# EAGLE schematic F2CE_V3_Main (EAGLE 9.6.2)
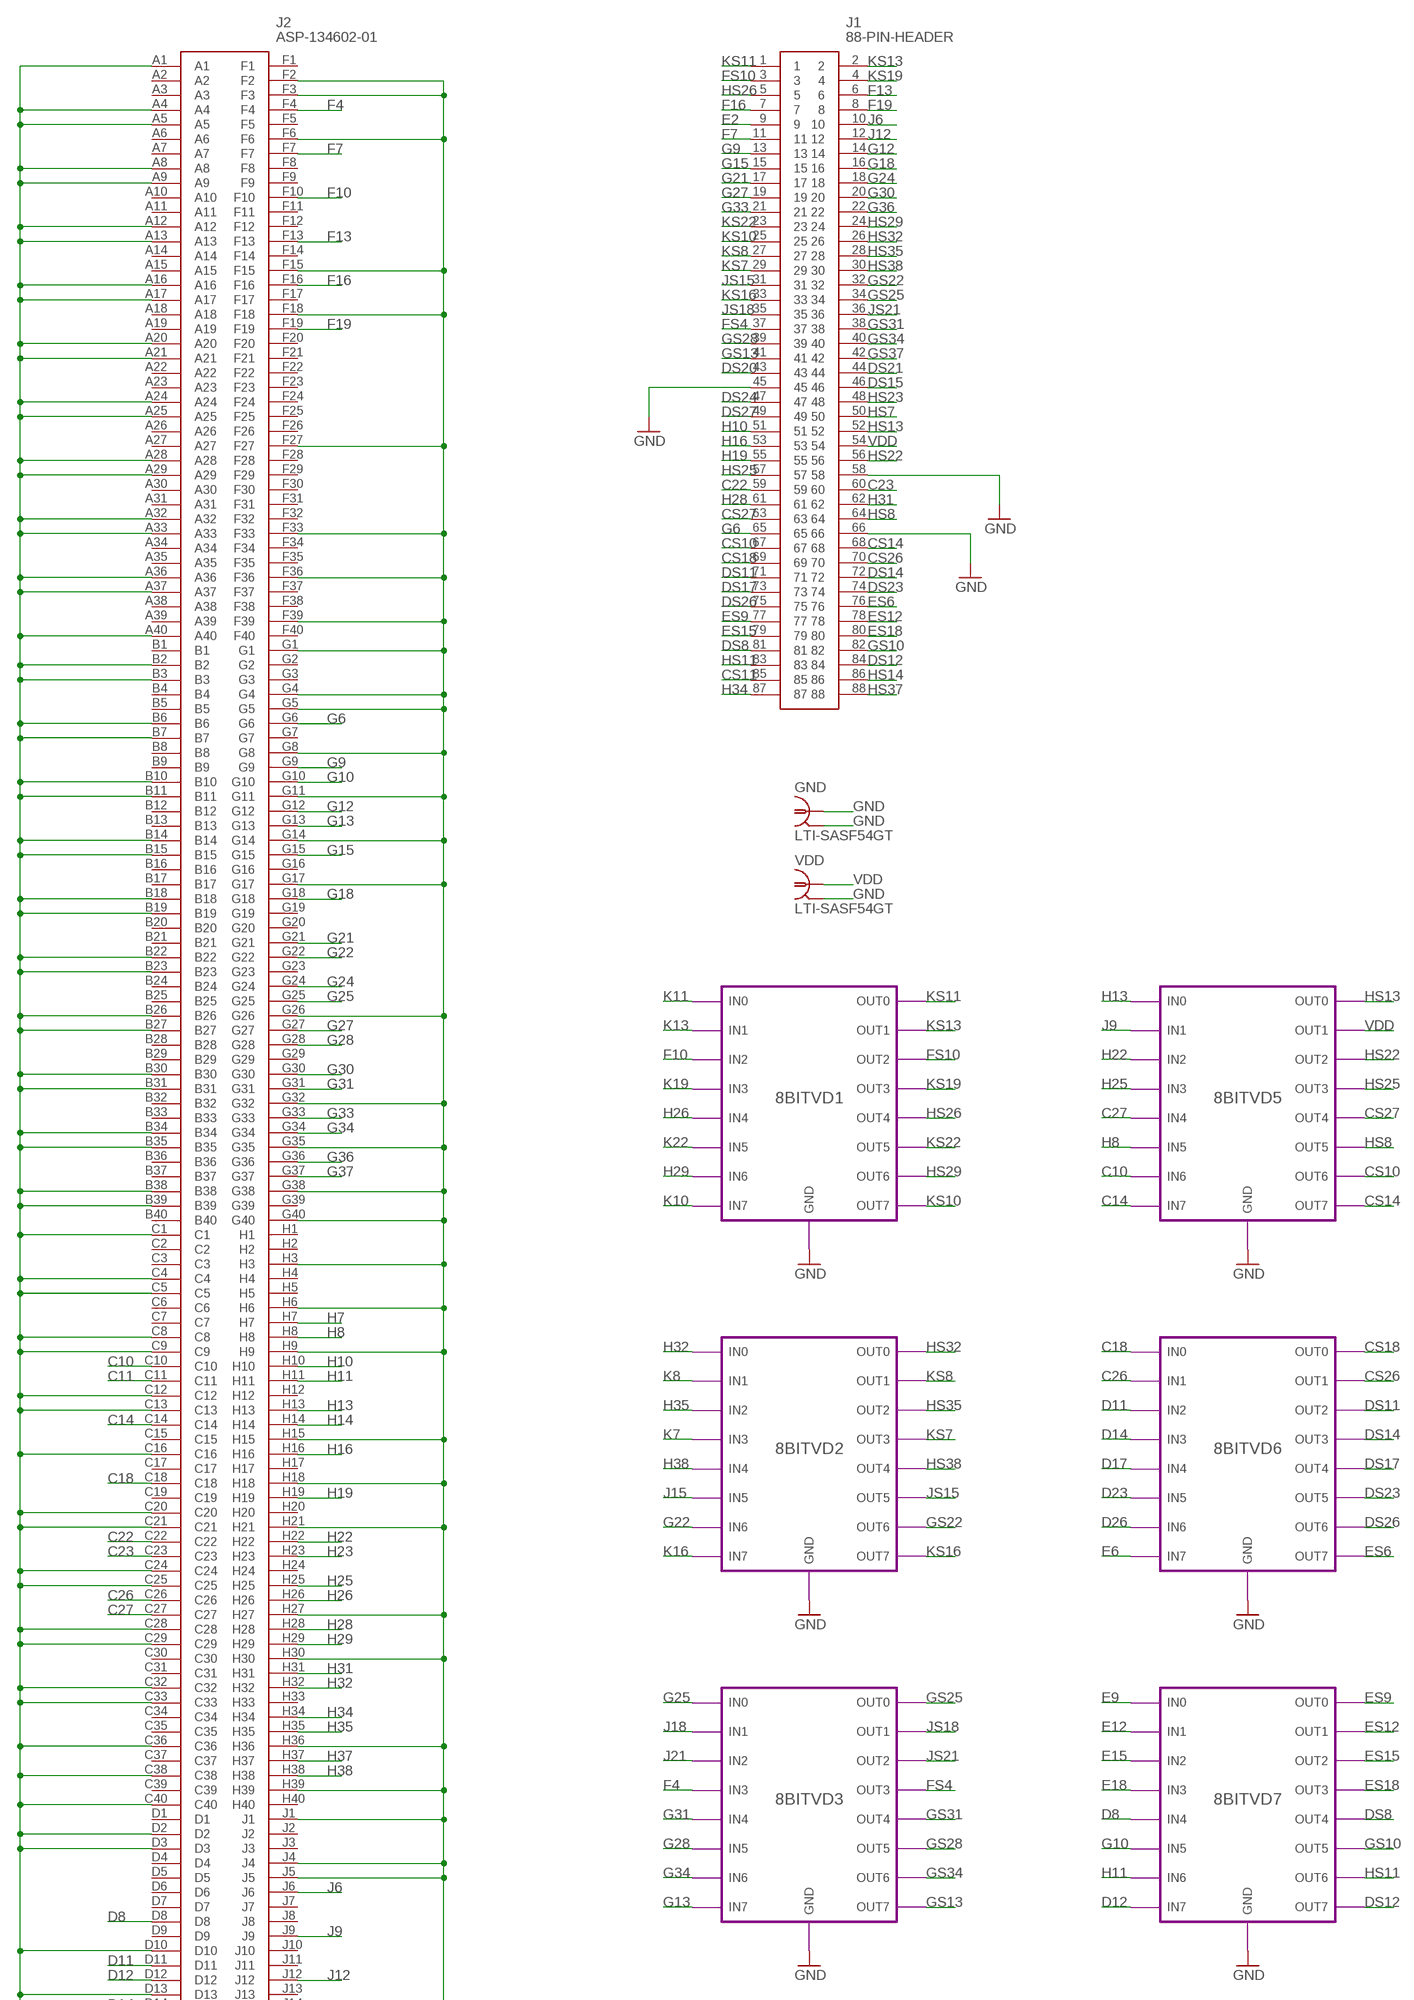
[diagram p0: schematic, sheet 1, part 1 of 2]
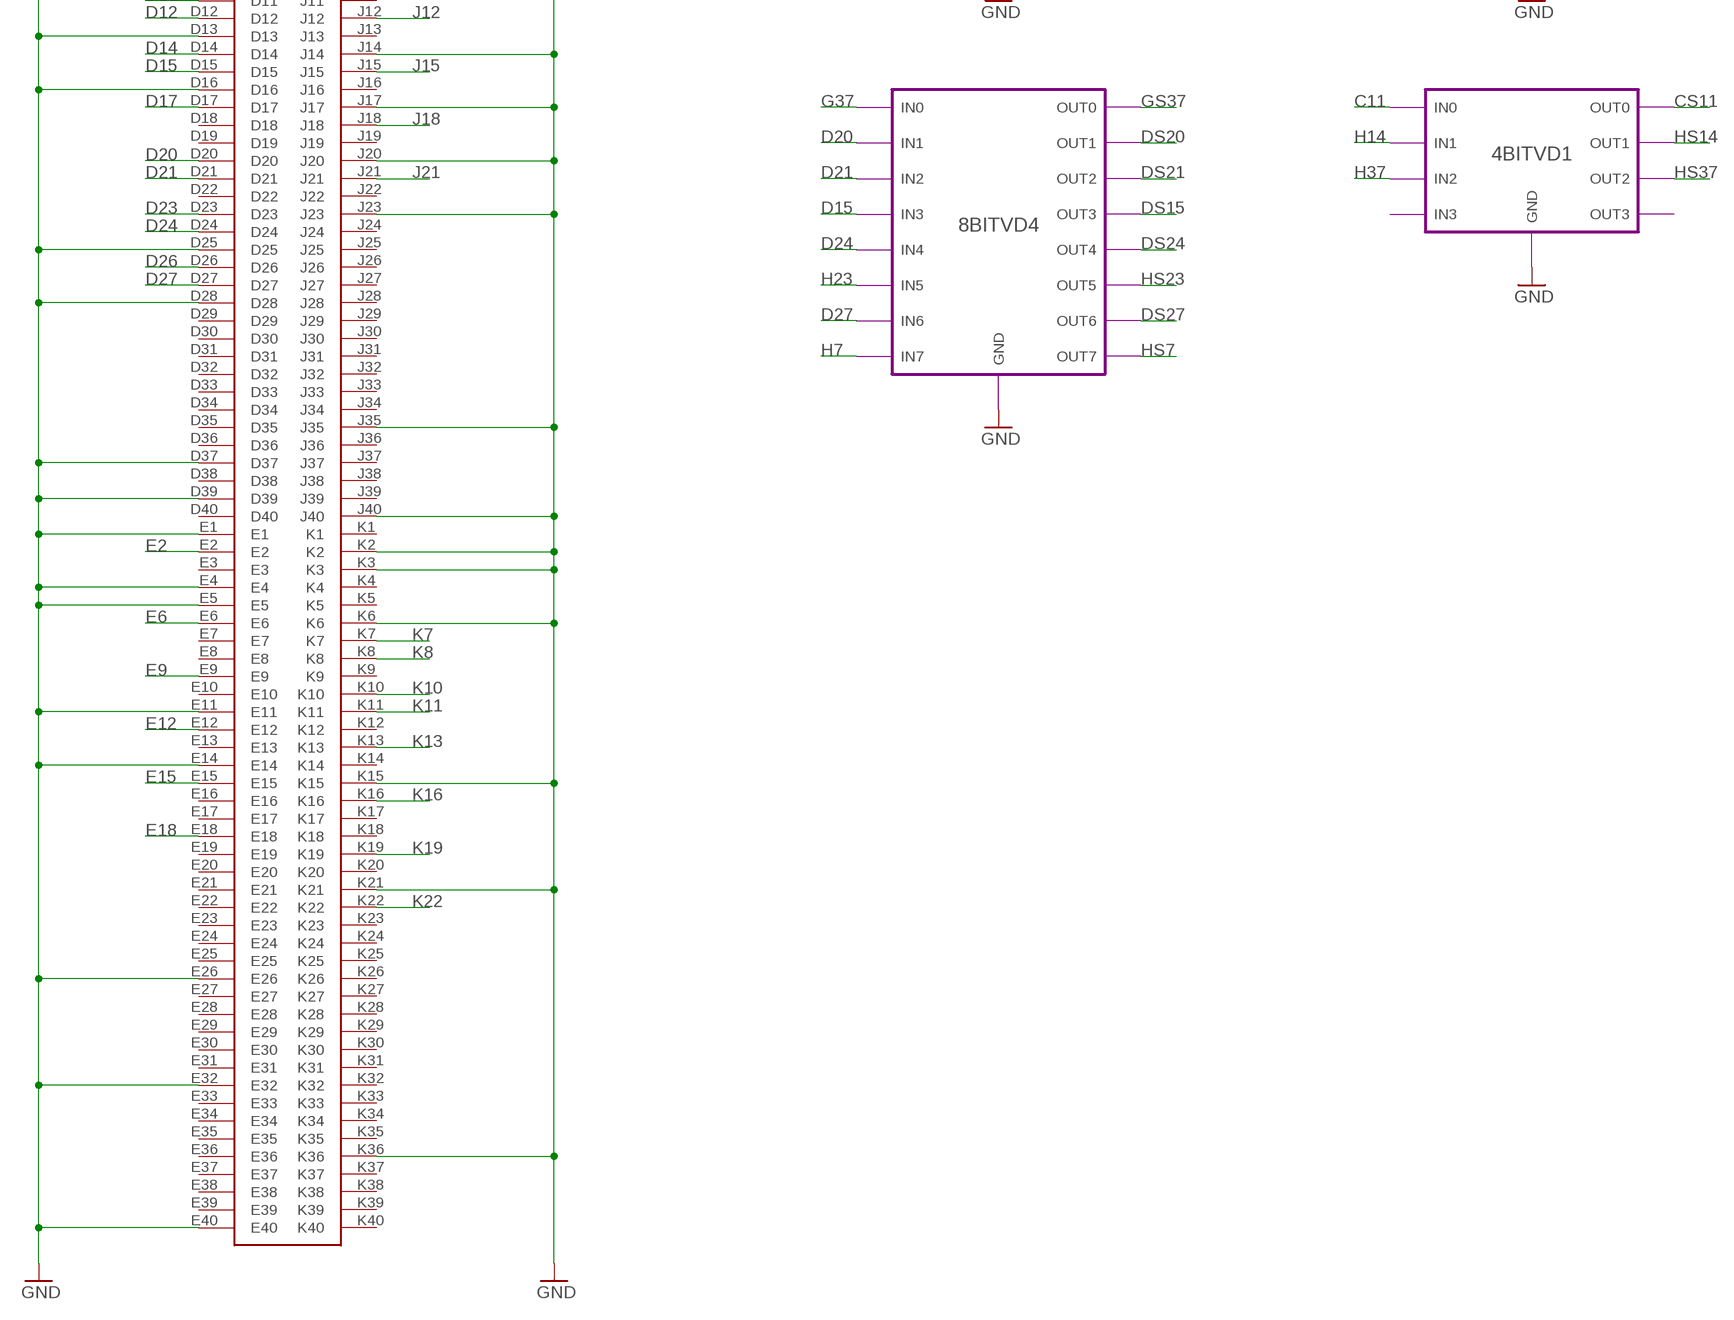
[diagram p1: schematic, sheet 1, part 2 of 2]

## Parts
GND  LTI-SASF54GT  [LTI-SASF54GT]
J1  88-PIN-HEADER  [88-PIN-HEADER]
J2  ASP-134602-01  [ASP13460201]
VDD  LTI-SASF54GT  [LTI-SASF54GT]

## Module instances
8BITVD1 = 8BITVD
8BITVD2 = 8BITVD
8BITVD3 = 8BITVD
8BITVD4 = 8BITVD
8BITVD5 = 8BITVD
8BITVD6 = 8BITVD
8BITVD7 = 8BITVD
4BITVD1 = 4BITVD

## Nets
C10: J2.C10 ; port 8BITVD5.IN6
C11: J2.C11 ; port 4BITVD1.IN0
C14: J2.C14 ; port 8BITVD5.IN7
C18: J2.C18 ; port 8BITVD6.IN0
C22: J1.59 J2.C22
C23: J1.60 J2.C23
C26: J2.C26 ; port 8BITVD6.IN1
C27: J2.C27 ; port 8BITVD5.IN4
CS10: J1.67 ; port 8BITVD5.OUT6
CS11: J1.85 ; port 4BITVD1.OUT0
CS14: J1.68 ; port 8BITVD5.OUT7
CS18: J1.69 ; port 8BITVD6.OUT0
CS26: J1.70 ; port 8BITVD6.OUT1
CS27: J1.63 ; port 8BITVD5.OUT4
D8: J2.D8 ; port 8BITVD7.IN4
D11: J2.D11 ; port 8BITVD6.IN2
D12: J2.D12 ; port 8BITVD7.IN7
D14: J2.D14 ; port 8BITVD6.IN3
D15: J2.D15 ; port 8BITVD4.IN3
D17: J2.D17 ; port 8BITVD6.IN4
D20: J2.D20 ; port 8BITVD4.IN1
D21: J2.D21 ; port 8BITVD4.IN2
D23: J2.D23 ; port 8BITVD6.IN5
D24: J2.D24 ; port 8BITVD4.IN4
D26: J2.D26 ; port 8BITVD6.IN6
D27: J2.D27 ; port 8BITVD4.IN6
DS8: J1.81 ; port 8BITVD7.OUT4
DS11: J1.71 ; port 8BITVD6.OUT2
DS12: J1.84 ; port 8BITVD7.OUT7
DS14: J1.72 ; port 8BITVD6.OUT3
DS15: J1.46 ; port 8BITVD4.OUT3
DS17: J1.73 ; port 8BITVD6.OUT4
DS20: J1.43 ; port 8BITVD4.OUT1
DS21: J1.44 ; port 8BITVD4.OUT2
DS23: J1.74 ; port 8BITVD6.OUT5
DS24: J1.47 ; port 8BITVD4.OUT4
DS26: J1.75 ; port 8BITVD6.OUT6
DS27: J1.49 ; port 8BITVD4.OUT6
E2: J1.9 J2.E2
E6: J2.E6 ; port 8BITVD6.IN7
E9: J2.E9 ; port 8BITVD7.IN0
E12: J2.E12 ; port 8BITVD7.IN1
E15: J2.E15 ; port 8BITVD7.IN2
E18: J2.E18 ; port 8BITVD7.IN3
ES6: J1.76 ; port 8BITVD6.OUT7
ES9: J1.77 ; port 8BITVD7.OUT0
ES12: J1.78 ; port 8BITVD7.OUT1
ES15: J1.79 ; port 8BITVD7.OUT2
ES18: J1.80 ; port 8BITVD7.OUT3
F4: J2.F4 ; port 8BITVD3.IN3
F7: J1.11 J2.F7
F10: J2.F10 ; port 8BITVD1.IN2
F13: J1.6 J2.F13
F16: J1.7 J2.F16
F19: J1.8 J2.F19
FS4: J1.37 ; port 8BITVD3.OUT3
FS10: J1.3 ; port 8BITVD1.OUT2
G6: J1.65 J2.G6
G9: J1.13 J2.G9
G10: J2.G10 ; port 8BITVD7.IN5
G12: J1.14 J2.G12
G13: J2.G13 ; port 8BITVD3.IN7
G15: J1.15 J2.G15
G18: J1.16 J2.G18
G21: J1.17 J2.G21
G22: J2.G22 ; port 8BITVD2.IN6
G24: J1.18 J2.G24
G25: J2.G25 ; port 8BITVD3.IN0
G27: J1.19 J2.G27
G28: J2.G28 ; port 8BITVD3.IN5
G30: J1.20 J2.G30
G31: J2.G31 ; port 8BITVD3.IN4
G33: J1.21 J2.G33
G34: J2.G34 ; port 8BITVD3.IN6
G36: J1.22 J2.G36
G37: J2.G37 ; port 8BITVD4.IN0
GND: GND.1 GND.2 GND.3 GND.4 GND.5 J1.45 J1.58 J1.66 J2.A1 J2.A4 J2.A5 J2.A8 J2.A9 J2.A12 J2.A13 J2.A16 J2.A17 J2.A20 J2.A21 J2.A24 J2.A25 J2.A28 J2.A29 J2.A32 J2.A33 J2.A36 J2.A37 J2.A40 J2.B2 J2.B3 J2.B6 J2.B7 J2.B10 J2.B11 J2.B14 J2.B15 J2.B18 J2.B19 J2.B22 J2.B23 J2.B26 J2.B27 J2.B30 J2.B31 J2.B34 J2.B35 J2.B38 J2.B39 J2.C1 J2.C4 J2.C5 J2.C8 J2.C9 J2.C12 J2.C13 J2.C16 J2.C20 J2.C21 J2.C24 J2.C25 J2.C28 J2.C29 J2.C32 J2.C33 J2.C36 J2.C38 J2.C40 J2.D2 J2.D3 J2.D10 J2.D13 J2.D16 J2.D25 J2.D28 J2.D37 J2.D39 J2.E1 J2.E4 J2.E5 J2.E11 J2.E14 J2.E26 J2.E32 J2.E40 J2.F2 J2.F3 J2.F6 J2.F15 J2.F18 J2.F27 J2.F33 J2.F36 J2.F39 J2.G1 J2.G4 J2.G5 J2.G8 J2.G11 J2.G14 J2.G17 J2.G26 J2.G32 J2.G35 J2.G38 J2.G40 J2.H3 J2.H6 J2.H9 J2.H15 J2.H18 J2.H21 J2.H27 J2.H30 J2.H36 J2.H39 J2.J1 J2.J4 J2.J5 J2.J14 J2.J17 J2.J20 J2.J23 J2.J35 J2.J40 J2.K2 J2.K3 J2.K6 J2.K15 J2.K21 J2.K36 VDD.2 VDD.3 VDD.4 VDD.5 ; port 4BITVD1.GND 8BITVD4.GND 8BITVD3.GND 8BITVD7.GND 8BITVD6.GND 8BITVD2.GND 8BITVD1.GND 8BITVD5.GND
GS10: J1.82 ; port 8BITVD7.OUT5
GS13: J1.41 ; port 8BITVD3.OUT7
GS22: J1.32 ; port 8BITVD2.OUT6
GS25: J1.34 ; port 8BITVD3.OUT0
GS28: J1.39 ; port 8BITVD3.OUT5
GS31: J1.38 ; port 8BITVD3.OUT4
GS34: J1.40 ; port 8BITVD3.OUT6
GS37: J1.42 ; port 8BITVD4.OUT0
H7: J2.H7 ; port 8BITVD4.IN7
H8: J2.H8 ; port 8BITVD5.IN5
H10: J1.51 J2.H10
H11: J2.H11 ; port 8BITVD7.IN6
H13: J2.H13 ; port 8BITVD5.IN0
H14: J2.H14 ; port 4BITVD1.IN1
H16: J1.53 J2.H16
H19: J1.55 J2.H19
H22: J2.H22 ; port 8BITVD5.IN2
H23: J2.H23 ; port 8BITVD4.IN5
H25: J2.H25 ; port 8BITVD5.IN3
H26: J2.H26 ; port 8BITVD1.IN4
H28: J1.61 J2.H28
H29: J2.H29 ; port 8BITVD1.IN6
H31: J1.62 J2.H31
H32: J2.H32 ; port 8BITVD2.IN0
H34: J1.87 J2.H34
H35: J2.H35 ; port 8BITVD2.IN2
H37: J2.H37 ; port 4BITVD1.IN2
H38: J2.H38 ; port 8BITVD2.IN4
HS7: J1.50 ; port 8BITVD4.OUT7
HS8: J1.64 ; port 8BITVD5.OUT5
HS11: J1.83 ; port 8BITVD7.OUT6
HS13: J1.52 ; port 8BITVD5.OUT0
HS14: J1.86 ; port 4BITVD1.OUT1
HS22: J1.56 ; port 8BITVD5.OUT2
HS23: J1.48 ; port 8BITVD4.OUT5
HS25: J1.57 ; port 8BITVD5.OUT3
HS26: J1.5 ; port 8BITVD1.OUT4
HS29: J1.24 ; port 8BITVD1.OUT6
HS32: J1.26 ; port 8BITVD2.OUT0
HS35: J1.28 ; port 8BITVD2.OUT2
HS37: J1.88 ; port 4BITVD1.OUT2
HS38: J1.30 ; port 8BITVD2.OUT4
J6: J1.10 J2.J6
J9: J2.J9 ; port 8BITVD5.IN1
J12: J1.12 J2.J12
J15: J2.J15 ; port 8BITVD2.IN5
J18: J2.J18 ; port 8BITVD3.IN1
J21: J2.J21 ; port 8BITVD3.IN2
JS15: J1.31 ; port 8BITVD2.OUT5
JS18: J1.35 ; port 8BITVD3.OUT1
JS21: J1.36 ; port 8BITVD3.OUT2
K7: J2.K7 ; port 8BITVD2.IN3
K8: J2.K8 ; port 8BITVD2.IN1
K10: J2.K10 ; port 8BITVD1.IN7
K11: J2.K11 ; port 8BITVD1.IN0
K13: J2.K13 ; port 8BITVD1.IN1
K16: J2.K16 ; port 8BITVD2.IN7
K19: J2.K19 ; port 8BITVD1.IN3
K22: J2.K22 ; port 8BITVD1.IN5
KS7: J1.29 ; port 8BITVD2.OUT3
KS8: J1.27 ; port 8BITVD2.OUT1
KS10: J1.25 ; port 8BITVD1.OUT7
KS11: J1.1 ; port 8BITVD1.OUT0
KS13: J1.2 ; port 8BITVD1.OUT1
KS16: J1.33 ; port 8BITVD2.OUT7
KS19: J1.4 ; port 8BITVD1.OUT3
KS22: J1.23 ; port 8BITVD1.OUT5
VDD: J1.54 VDD.1 ; port 8BITVD5.OUT1
Unconnected: J2.A2 J2.A3 J2.A6 J2.A7 J2.A10 J2.A11 J2.A14 J2.A15 J2.A18 J2.A19 J2.A22 J2.A23 J2.A26 J2.A27 J2.A30 J2.A31 J2.A34 J2.A35 J2.A38 J2.A39 J2.B1 J2.B4 J2.B5 J2.B8 J2.B9 J2.B12 J2.B13 J2.B16 J2.B17 J2.B20 J2.B21 J2.B24 J2.B25 J2.B28 J2.B29 J2.B32 J2.B33 J2.B36 J2.B37 J2.B40 J2.C2 J2.C3 J2.C6 J2.C7 J2.C15 J2.C17 J2.C19 J2.C30 J2.C31 J2.C34 J2.C35 J2.C37 J2.C39 J2.D1 J2.D4 J2.D5 J2.D6 J2.D7 J2.D9 J2.D18 J2.D19 J2.D22 J2.D29 J2.D30 J2.D31 J2.D32 J2.D33 J2.D34 J2.D35 J2.D36 J2.D38 J2.D40 J2.E3 J2.E7 J2.E8 J2.E10 J2.E13 J2.E16 J2.E17 J2.E19 J2.E20 J2.E21 J2.E22 J2.E23 J2.E24 J2.E25 J2.E27 J2.E28 J2.E29 J2.E30 J2.E31 J2.E33 J2.E34 J2.E35 J2.E36 J2.E37 J2.E38 J2.E39 J2.F1 J2.F5 J2.F8 J2.F9 J2.F11 J2.F12 J2.F14 J2.F17 J2.F20 J2.F21 J2.F22 J2.F23 J2.F24 J2.F25 J2.F26 J2.F28 J2.F29 J2.F30 J2.F31 J2.F32 J2.F34 J2.F35 J2.F37 J2.F38 J2.F40 J2.G2 J2.G3 J2.G7 J2.G16 J2.G19 J2.G20 J2.G23 J2.G29 J2.G39 J2.H1 J2.H2 J2.H4 J2.H5 J2.H12 J2.H17 J2.H20 J2.H24 J2.H33 J2.H40 J2.J2 J2.J3 J2.J7 J2.J8 J2.J10 J2.J11 J2.J13 J2.J16 J2.J19 J2.J22 J2.J24 J2.J25 J2.J26 J2.J27 J2.J28 J2.J29 J2.J30 J2.J31 J2.J32 J2.J33 J2.J34 J2.J36 J2.J37 J2.J38 J2.J39 J2.K1 J2.K4 J2.K5 J2.K9 J2.K12 J2.K14 J2.K17 J2.K18 J2.K20 J2.K23 J2.K24 J2.K25 J2.K26 J2.K27 J2.K28 J2.K29 J2.K30 J2.K31 J2.K32 J2.K33 J2.K34 J2.K35 J2.K37 J2.K38 J2.K39 J2.K40

## Library data of the parts
GND VDD = con-coax:LTI-SASF54GT: SMA vertical PCB thrue hole jack Source: Lighthorse Technologies, inc. SASF54GT.pdf; OC_FARNELL: unknown; OC_NEWARK: unknown
J1 = 88-PIN-HEADER:88-PIN-HEADER: Headers & Wire Housings CGrid Bkwy Hdr DR Rt DR RtPn 15''SAu 4Ckt Source: Datasheet <https://www.molex.com/pdm_docs/sd/702871098_sd.pdf>; DESCRIPTION: Headers & Wire Housings CGrid Bkwy Hdr DR Rt DR RtPn 15''SAu 4Ckt; HEIGHT: 8.51mm; MANUFACTURER_NAME: Molex; MANUFACTURER_PART_NUMBER: 70287-1098; MOUSER_PART_NUMBER: 538-70287-1098; MOUSER_PRICE-STOCK: https://www.mouser.co.uk/ProductDetail/Molex/70287-1098?qs=kYQSPAH4sJyJ%2F7vCw3ffjg%3D%3D
J2 = ASP-134602-01:ASP-134602-01: Samtec ASP Series 1.27mm Pitch 400 Way 10 Row PCB Socket, Through Hole, Solder Termination Source: Datasheet <https://componentsearchengine.com/Datasheets/2/ASP-134602-01.pdf>; DESCRIPTION: Samtec ASP Series 1.27mm Pitch 400 Way 10 Row PCB Socket, Through Hole, Solder Termination; HEIGHT: 5.74mm; MANUFACTURER_NAME: SAMTEC; MANUFACTURER_PART_NUMBER: ASP-134602-01; MOUSER_PART_NUMBER: 200-ASP-134602-01; MOUSER_PRICE-STOCK: https://www.mouser.co.uk/ProductDetail/Samtec/ASP-134602-01?qs=FESYatJ8odJXL2em%252Bh4I4Q%3D%3D

## Module 8BITVD
Ports: IN0(io) IN1(io) IN2(io) IN3(io) IN4(io) IN5(io) IN6(io) IN7(io) OUT0(io) OUT1(io) OUT2(io) OUT3(io) OUT4(io) OUT5(io) OUT6(io) OUT7(io) GND(io)
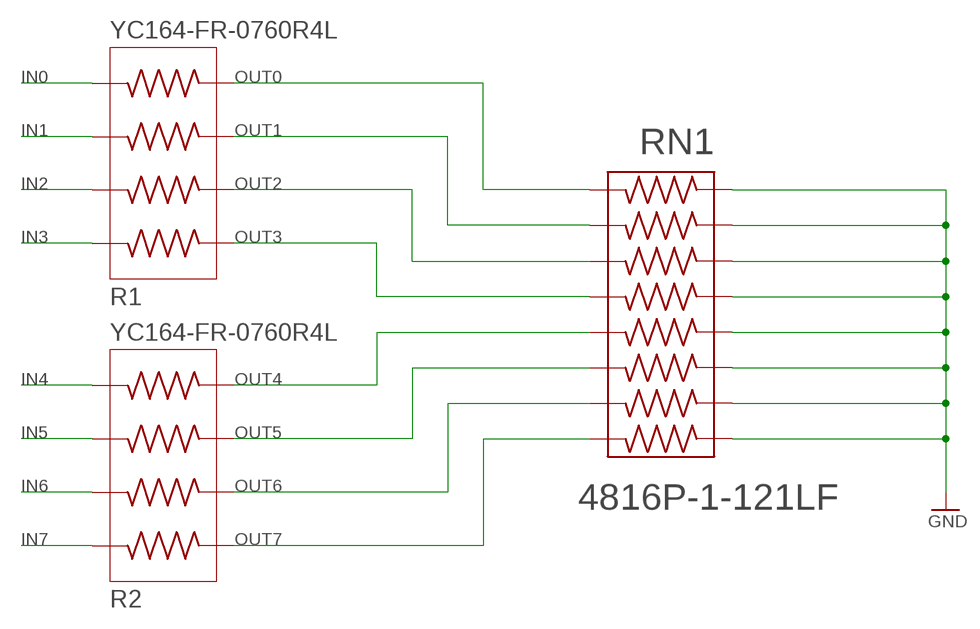
[diagram p2: schematic, module 8BITVD, sheet 1]

### Parts
R1  YC164-FR-0760R4L  [RESCAXE80P320X160X70-8N]
R2  YC164-FR-0760R4L  [RESCAXE80P320X160X70-8N]
RN1  4816P-1-121LF  [SOIC127P762X240-16N]

### Nets
GND: RN1.1 RN1.2 RN1.3 RN1.4 RN1.5 RN1.6 RN1.7 RN1.8
IN0: R1.4
IN1: R1.3
IN2: R1.2
IN3: R1.1
IN4: R2.4
IN5: R2.3
IN6: R2.2
IN7: R2.1
OUT0: R1.8 RN1.16
OUT1: R1.7 RN1.15
OUT2: R1.6 RN1.14
OUT3: R1.5 RN1.13
OUT4: R2.8 RN1.12
OUT5: R2.7 RN1.11
OUT6: R2.6 RN1.10
OUT7: R2.5 RN1.9

### Library data of the parts
R1 R2 = YC164-FR-0760R4L:YC164-FR-0760R4L: Res Thick Film Array 100 Ohm 5% ?200ppm/C ISOL Epoxy 8-Pin 1206(4 X 0603) Convex SMD T/R Check availability <https://pricing.snapeda.com/parts/YC164-FR-0760R4L/Yageo/view-part?ref=eda>; AVAILABILITY: In Stock; DESCRIPTION: 60.4 Ohm ±1% 62.5mW Power Per Element Isolated 4 Resistor Network/Array ±200ppm/°C 1206 (3216 Metric), Convex, Long Side Terminals; MF: Yageo; MP: YC164-FR-0760R4L; PACKAGE: 1206 Yageo; PRICE: None; PURCHASE-URL: https://pricing.snapeda.com/search/part/YC164-FR-0760R4L/?ref=eda
RN1 = 4816P-1-121LF:4816P-1-121LF: Res Thick Film NET 68K Ohm 2% 1.28W ±100ppm/C ISOL Molded 16-Pin SOM Gull Wing SMD Automotive T/R Check availability <https://pricing.snapeda.com/parts/4816P-1-121LF/Bourns/view-part?ref=eda>; AVAILABILITY: In Stock; DESCRIPTION: 120 Ohm ±2% 160mW Power Per Element Isolated 8 Resistor Network/Array ±100ppm/°C 16-SOIC (0.220, 5.59mm Width); MF: Bourns; MP: 4816P-1-121LF; PACKAGE: SOIC-16 Bourns; PRICE: None; PURCHASE-URL: https://pricing.snapeda.com/search/part/4816P-1-121LF/?ref=eda

## Module 4BITVD
Ports: IN0(io) IN2(io) IN1(io) IN3(io) OUT0(io) OUT1(io) OUT2(io) OUT3(io) GND(io)
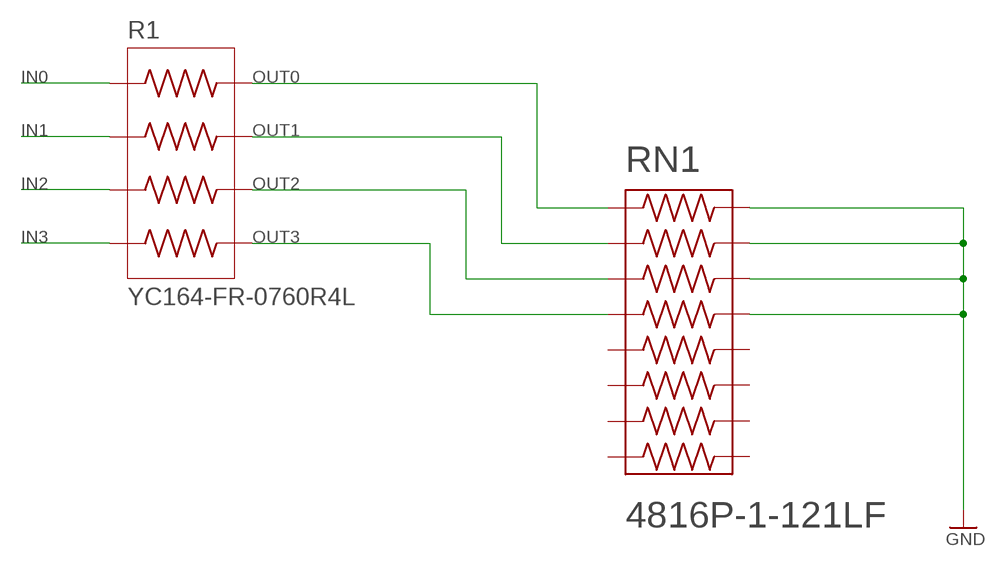
[diagram p3: schematic, module 4BITVD, sheet 1]

### Parts
R1  YC164-FR-0760R4L  [RESCAXE80P320X160X70-8N]
RN1  4816P-1-121LF  [SOIC127P762X240-16N]

### Nets
GND: RN1.13 RN1.14 RN1.15 RN1.16
IN0: R1.1
IN1: R1.2
IN2: R1.3
IN3: R1.4
OUT0: R1.5 RN1.1
OUT1: R1.6 RN1.2
OUT2: R1.7 RN1.3
OUT3: R1.8 RN1.4
Unconnected: RN1.5 RN1.6 RN1.7 RN1.8 RN1.9 RN1.10 RN1.11 RN1.12

### Library data of the parts
R1 = YC164-FR-0760R4L:YC164-FR-0760R4L: Res Thick Film Array 100 Ohm 5% ?200ppm/C ISOL Epoxy 8-Pin 1206(4 X 0603) Convex SMD T/R Check availability <https://pricing.snapeda.com/parts/YC164-FR-0760R4L/Yageo/view-part?ref=eda>; AVAILABILITY: In Stock; DESCRIPTION: 60.4 Ohm ±1% 62.5mW Power Per Element Isolated 4 Resistor Network/Array ±200ppm/°C 1206 (3216 Metric), Convex, Long Side Terminals; MF: Yageo; MP: YC164-FR-0760R4L; PACKAGE: 1206 Yageo; PRICE: None; PURCHASE-URL: https://pricing.snapeda.com/search/part/YC164-FR-0760R4L/?ref=eda
RN1 = 4816P-1-121LF:4816P-1-121LF: Res Thick Film NET 68K Ohm 2% 1.28W ±100ppm/C ISOL Molded 16-Pin SOM Gull Wing SMD Automotive T/R Check availability <https://pricing.snapeda.com/parts/4816P-1-121LF/Bourns/view-part?ref=eda>; AVAILABILITY: In Stock; DESCRIPTION: 120 Ohm ±2% 160mW Power Per Element Isolated 8 Resistor Network/Array ±100ppm/°C 16-SOIC (0.220, 5.59mm Width); MF: Bourns; MP: 4816P-1-121LF; PACKAGE: SOIC-16 Bourns; PRICE: None; PURCHASE-URL: https://pricing.snapeda.com/search/part/4816P-1-121LF/?ref=eda